# EAGLE schematic uno-level-shifter-v2 (EAGLE 9.6.2)

## Sheet 1 of 4
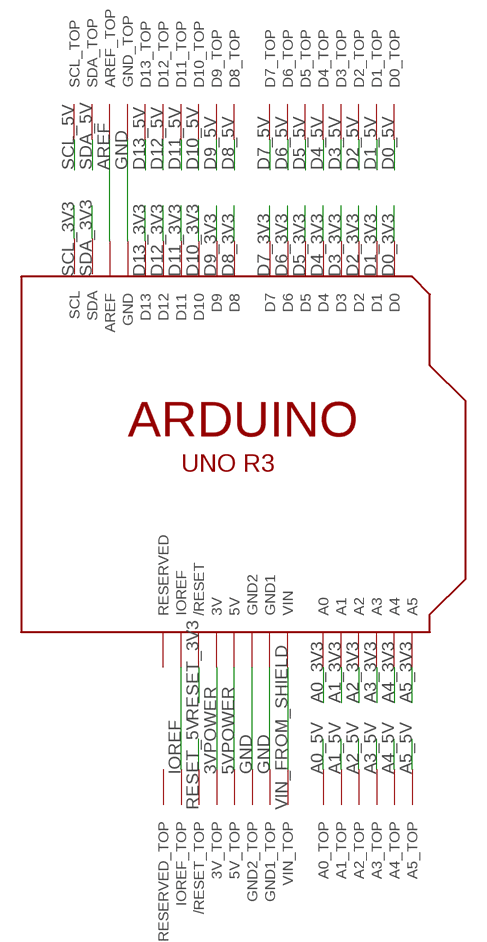
[diagram p0: schematic, sheet 1]

### Parts
U1  ARDUINOR3-DIMENSION  [ARDUINOR3]

### Nets
3VPOWER: U1.3V U1.3V_TOP
5VPOWER: U1.5V U1.5V_TOP ; also sheet 2
A0_3V3: U1.A0 ; also sheet 3
A0_5V: U1.A0_TOP ; also sheet 3
A1_3V3: U1.A1 ; also sheet 3
A1_5V: U1.A1_TOP ; also sheet 3
A2_3V3: U1.A2 ; also sheet 3
A2_5V: U1.A2_TOP ; also sheet 3
A3_3V3: U1.A3 ; also sheet 3
A3_5V: U1.A3_TOP ; also sheet 3
A4_3V3: U1.A4 ; also sheet 3
A4_5V: U1.A4_TOP ; also sheet 3
A5_3V3: U1.A5 ; also sheet 3
A5_5V: U1.A5_TOP ; also sheet 3
AREF: U1.AREF U1.AREF_TOP
D0_3V3: U1.D0 ; also sheet 2
D0_5V: U1.D0_TOP ; also sheet 2
D1_3V3: U1.D1 ; also sheet 2
D1_5V: U1.D1_TOP ; also sheet 2
D2_3V3: U1.D2 ; also sheet 2
D2_5V: U1.D2_TOP ; also sheet 2
D3_3V3: U1.D3 ; also sheet 2
D3_5V: U1.D3_TOP ; also sheet 2
D4_3V3: U1.D4 ; also sheet 2
D4_5V: U1.D4_TOP ; also sheet 2
D5_3V3: U1.D5 ; also sheet 2
D5_5V: U1.D5_TOP ; also sheet 2
D6_3V3: U1.D6 ; also sheet 2
D6_5V: U1.D6_TOP ; also sheet 2
D7_3V3: U1.D7 ; also sheet 2
D7_5V: U1.D7_TOP ; also sheet 2
D8_3V3: U1.D8 ; also sheet 2
D8_5V: U1.D8_TOP ; also sheet 2
D9_3V3: U1.D9 ; also sheet 2
D9_5V: U1.D9_TOP ; also sheet 2
D10_3V3: U1.D10 ; also sheet 2
D10_5V: U1.D10_TOP ; also sheet 2
D11_3V3: U1.D11 ; also sheet 2
D11_5V: U1.D11_TOP ; also sheet 2
D12_3V3: U1.D12 ; also sheet 2
D12_5V: U1.D12_TOP ; also sheet 2
D13_3V3: U1.D13 ; also sheet 2
D13_5V: U1.D13_TOP ; also sheet 2
GND: U1.GND U1.GND1 U1.GND1_TOP U1.GND2 U1.GND2_TOP U1.GND_TOP ; also sheet 2,3
IOREF: U1.IOREF U1.IOREF_TOP ; also sheet 2
RESET_3V3: U1.RESET(/RESET) ; also sheet 2
RESET_5V: U1.RESET_TOP(/RESET_TOP) ; also sheet 2
SCL_3V3: U1.SCL ; also sheet 2
SCL_5V: U1.SCL_TOP ; also sheet 2
SDA_3V3: U1.SDA ; also sheet 2
SDA_5V: U1.SDA_TOP ; also sheet 2
VIN_FROM_SHIELD: U1.VIN U1.VIN_TOP
Unconnected: U1.RESERVED U1.RESERVED_TOP

## Sheet 2 of 4
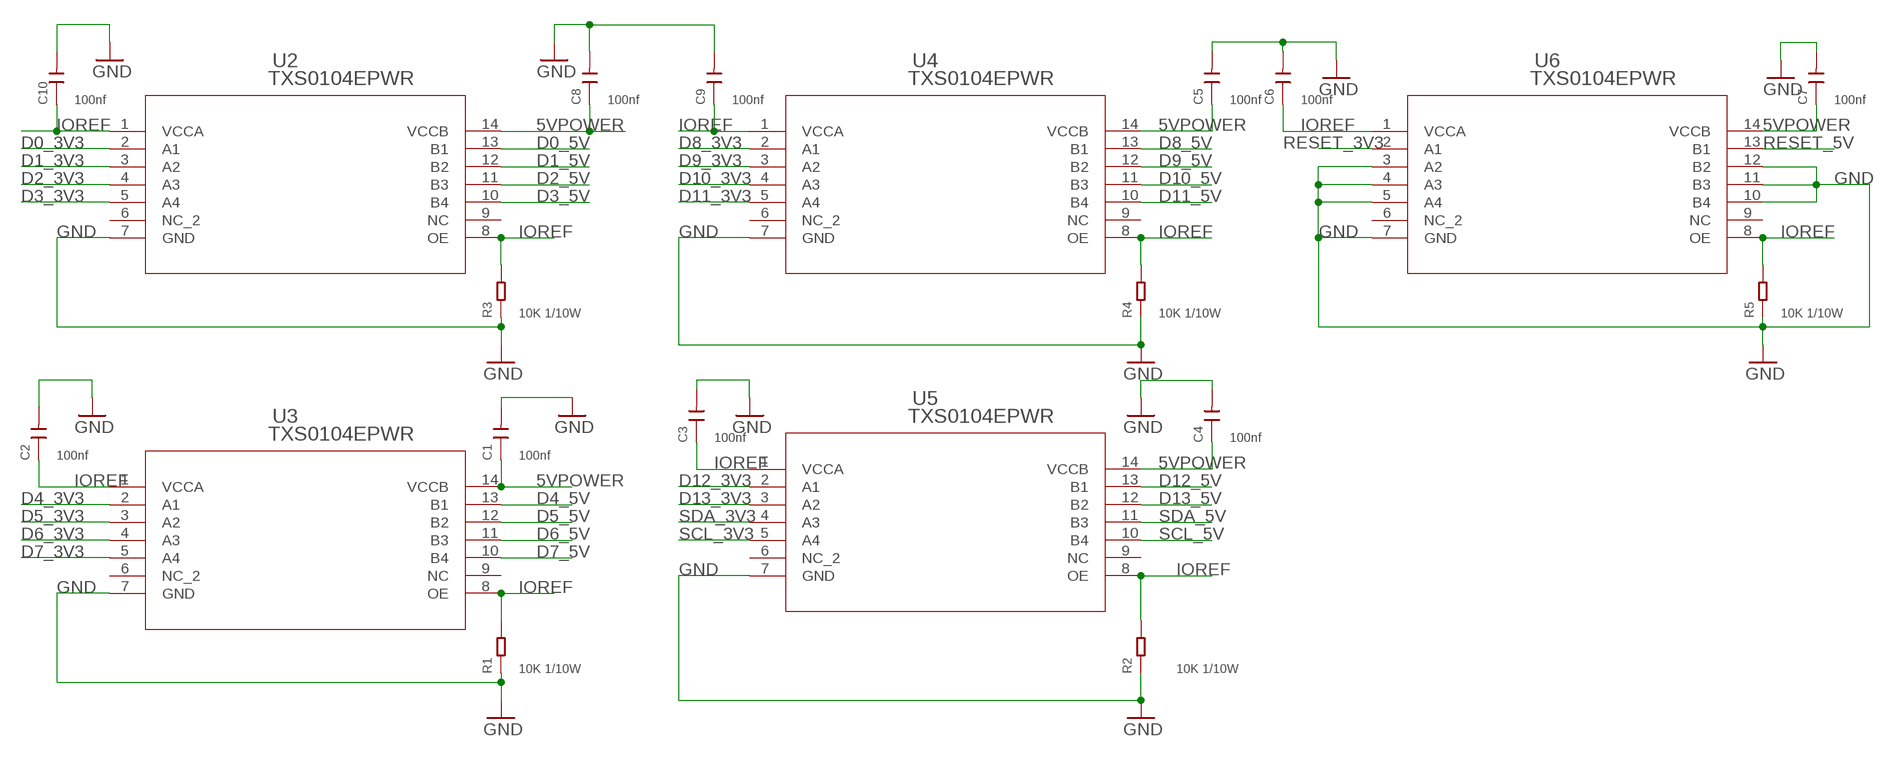
[diagram p1: schematic, sheet 2]

### Parts
C1  100nf  CERAMIC-100NF-50V-10%-X7R(0603)  [C0603]
C2  100nf  CERAMIC-100NF-50V-10%-X7R(0603)  [C0603]
C3  100nf  CERAMIC-100NF-50V-10%-X7R(0603)  [C0603]
C4  100nf  CERAMIC-100NF-50V-10%-X7R(0603)  [C0603]
C5  100nf  CERAMIC-100NF-50V-10%-X7R(0603)  [C0603]
C6  100nf  CERAMIC-100NF-50V-10%-X7R(0603)  [C0603]
C7  100nf  CERAMIC-100NF-50V-10%-X7R(0603)  [C0603]
C8  100nf  CERAMIC-100NF-50V-10%-X7R(0603)  [C0603]
C9  100nf  CERAMIC-100NF-50V-10%-X7R(0603)  [C0603]
C10  100nf  CERAMIC-100NF-50V-10%-X7R(0603)  [C0603]
R1  10K 1/10W  SMD-RES-10K-5%-1/10W(0603)  [R0603]
R2  10K 1/10W  SMD-RES-10K-5%-1/10W(0603)  [R0603]
R3  10K 1/10W  SMD-RES-10K-5%-1/10W(0603)  [R0603]
R4  10K 1/10W  SMD-RES-10K-5%-1/10W(0603)  [R0603]
R5  10K 1/10W  SMD-RES-10K-5%-1/10W(0603)  [R0603]
U2  TXS0104EPWR  [PW14]
U3  TXS0104EPWR  [PW14]
U4  TXS0104EPWR  [PW14]
U5  TXS0104EPWR  [PW14]
U6  TXS0104EPWR  [PW14]

### Nets
5VPOWER: C1.1 C4.1 C5.1 C7.1 C8.1 U2.14(VCCB) U3.14(VCCB) U4.14(VCCB) U5.14(VCCB) U6.14(VCCB) ; also sheet 1
D0_3V3: U2.2(A1) ; also sheet 1
D0_5V: U2.13(B1) ; also sheet 1
D1_3V3: U2.3(A2) ; also sheet 1
D1_5V: U2.12(B2) ; also sheet 1
D2_3V3: U2.4(A3) ; also sheet 1
D2_5V: U2.11(B3) ; also sheet 1
D3_3V3: U2.5(A4) ; also sheet 1
D3_5V: U2.10(B4) ; also sheet 1
D4_3V3: U3.2(A1) ; also sheet 1
D4_5V: U3.13(B1) ; also sheet 1
D5_3V3: U3.3(A2) ; also sheet 1
D5_5V: U3.12(B2) ; also sheet 1
D6_3V3: U3.4(A3) ; also sheet 1
D6_5V: U3.11(B3) ; also sheet 1
D7_3V3: U3.5(A4) ; also sheet 1
D7_5V: U3.10(B4) ; also sheet 1
D8_3V3: U4.2(A1) ; also sheet 1
D8_5V: U4.13(B1) ; also sheet 1
D9_3V3: U4.3(A2) ; also sheet 1
D9_5V: U4.12(B2) ; also sheet 1
D10_3V3: U4.4(A3) ; also sheet 1
D10_5V: U4.11(B3) ; also sheet 1
D11_3V3: U4.5(A4) ; also sheet 1
D11_5V: U4.10(B4) ; also sheet 1
D12_3V3: U5.2(A1) ; also sheet 1
D12_5V: U5.13(B1) ; also sheet 1
D13_3V3: U5.3(A2) ; also sheet 1
D13_5V: U5.12(B2) ; also sheet 1
GND: C1.2 C2.2 C3.2 C4.2 C5.2 C6.2 C7.2 C8.2 C9.2 C10.2 R1.1 R2.1 R3.1 R4.1 R5.1 U2.7(GND) U3.7(GND) U4.7(GND) U5.7(GND) U6.3(A2) U6.4(A3) U6.5(A4) U6.7(GND) U6.10(B4) U6.11(B3) U6.12(B2) ; also sheet 1,3
IOREF: C2.1 C3.1 C6.1 C9.1 C10.1 R1.2 R2.2 R3.2 R4.2 R5.2 U2.1(VCCA) U2.8(OE) U3.1(VCCA) U3.8(OE) U4.1(VCCA) U4.8(OE) U5.1(VCCA) U5.8(OE) U6.1(VCCA) U6.8(OE) ; also sheet 1
RESET_3V3: U6.2(A1) ; also sheet 1
RESET_5V: U6.13(B1) ; also sheet 1
SCL_3V3: U5.5(A4) ; also sheet 1
SCL_5V: U5.10(B4) ; also sheet 1
SDA_3V3: U5.4(A3) ; also sheet 1
SDA_5V: U5.11(B3) ; also sheet 1
Unconnected: U2.6(NC_2) U2.9(NC) U3.6(NC_2) U3.9(NC) U4.6(NC_2) U4.9(NC) U5.6(NC_2) U5.9(NC) U6.6(NC_2) U6.9(NC)

## Sheet 3 of 4
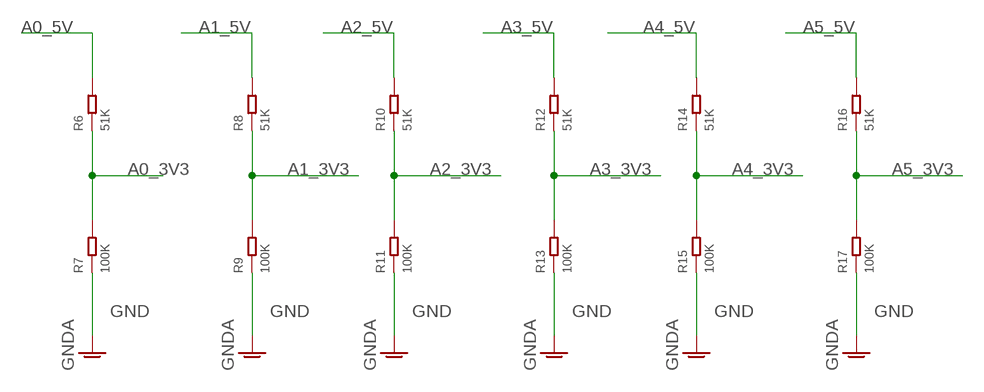
[diagram p2: schematic, sheet 3]

### Parts
R6  51K  SMD-RES-51K-1%-1/10W(0603)  [R0603]
R7  100K  SMD-RES-100K-1%-1/10W(0603)  [R0603]
R8  51K  SMD-RES-51K-1%-1/10W(0603)  [R0603]
R9  100K  SMD-RES-100K-1%-1/10W(0603)  [R0603]
R10  51K  SMD-RES-51K-1%-1/10W(0603)  [R0603]
R11  100K  SMD-RES-100K-1%-1/10W(0603)  [R0603]
R12  51K  SMD-RES-51K-1%-1/10W(0603)  [R0603]
R13  100K  SMD-RES-100K-1%-1/10W(0603)  [R0603]
R14  51K  SMD-RES-51K-1%-1/10W(0603)  [R0603]
R15  100K  SMD-RES-100K-1%-1/10W(0603)  [R0603]
R16  51K  SMD-RES-51K-1%-1/10W(0603)  [R0603]
R17  100K  SMD-RES-100K-1%-1/10W(0603)  [R0603]

### Nets
A0_3V3: R6.1 R7.2 ; also sheet 1
A0_5V: R6.2 ; also sheet 1
A1_3V3: R8.1 R9.2 ; also sheet 1
A1_5V: R8.2 ; also sheet 1
A2_3V3: R10.1 R11.2 ; also sheet 1
A2_5V: R10.2 ; also sheet 1
A3_3V3: R12.1 R13.2 ; also sheet 1
A3_5V: R12.2 ; also sheet 1
A4_3V3: R14.1 R15.2 ; also sheet 1
A4_5V: R14.2 ; also sheet 1
A5_3V3: R16.1 R17.2 ; also sheet 1
A5_5V: R16.2 ; also sheet 1
GND: R7.1 R9.1 R11.1 R13.1 R15.1 R17.1 ; supply symbol labelled GNDA ; also sheet 1,2

## Sheet 4 of 4

## Library data of the parts
C1-C10 = OPL_Capacitor:CERAMIC-100NF-50V-10%-X7R(0603): 302010138; MPN: CC0603KRX7R9BB104
R1-R5 = OPL_Resistor:SMD-RES-10K-5%-1/10W(0603): 301010293; MPN: RC0603JR-0710KL
R6 R8 R10 R12 R14 R16 = OPL_Resistor:SMD-RES-51K-1%-1/10W(0603): 301012083; MPN: RC0603FR-071K5L; VALUE: 1.5K
R7 R9 R11 R13 R15 R17 = OPL_Resistor:SMD-RES-100K-1%-1/10W(0603): 301010196; MPN: RC0603FR-07100KL
U1 = adadfruit-arduinor3-adapter-v1:ARDUINOR3: This is a new object for the new Arduino R3 - with extra pins that you may want to use (such as IOref, and duplicated A4/A5
U2-U6 = txs0104:TXS0104EPWR; DATASHEET_URL: http://www.ti.com/lit/gpn/TXS0104E; DESCRIPTION: 4-Bit Bidirectional Voltage-Level Translator for Open-Drain Applications; FAMILY_NAME: AUTO DIRECTION SENSING DUAL SUPPLY TRANSLATOR; GENERIC_PART_NUMBER: TXS0104E; INDUSTRY_STD_PKG_TYPE: TSSOP; MANUFACTURER: Texas Instruments; MANUFACTURER_PART_NUMBER: TXS0104EPWR; PACKAGE_DESIGNATOR: PW; PIN_COUNT: 14; VENDOR: Texas Instruments